# Altium schematic sheet Power_Generation.SchDoc
size A3; SheetNumber: 2; SheetTotal: 12
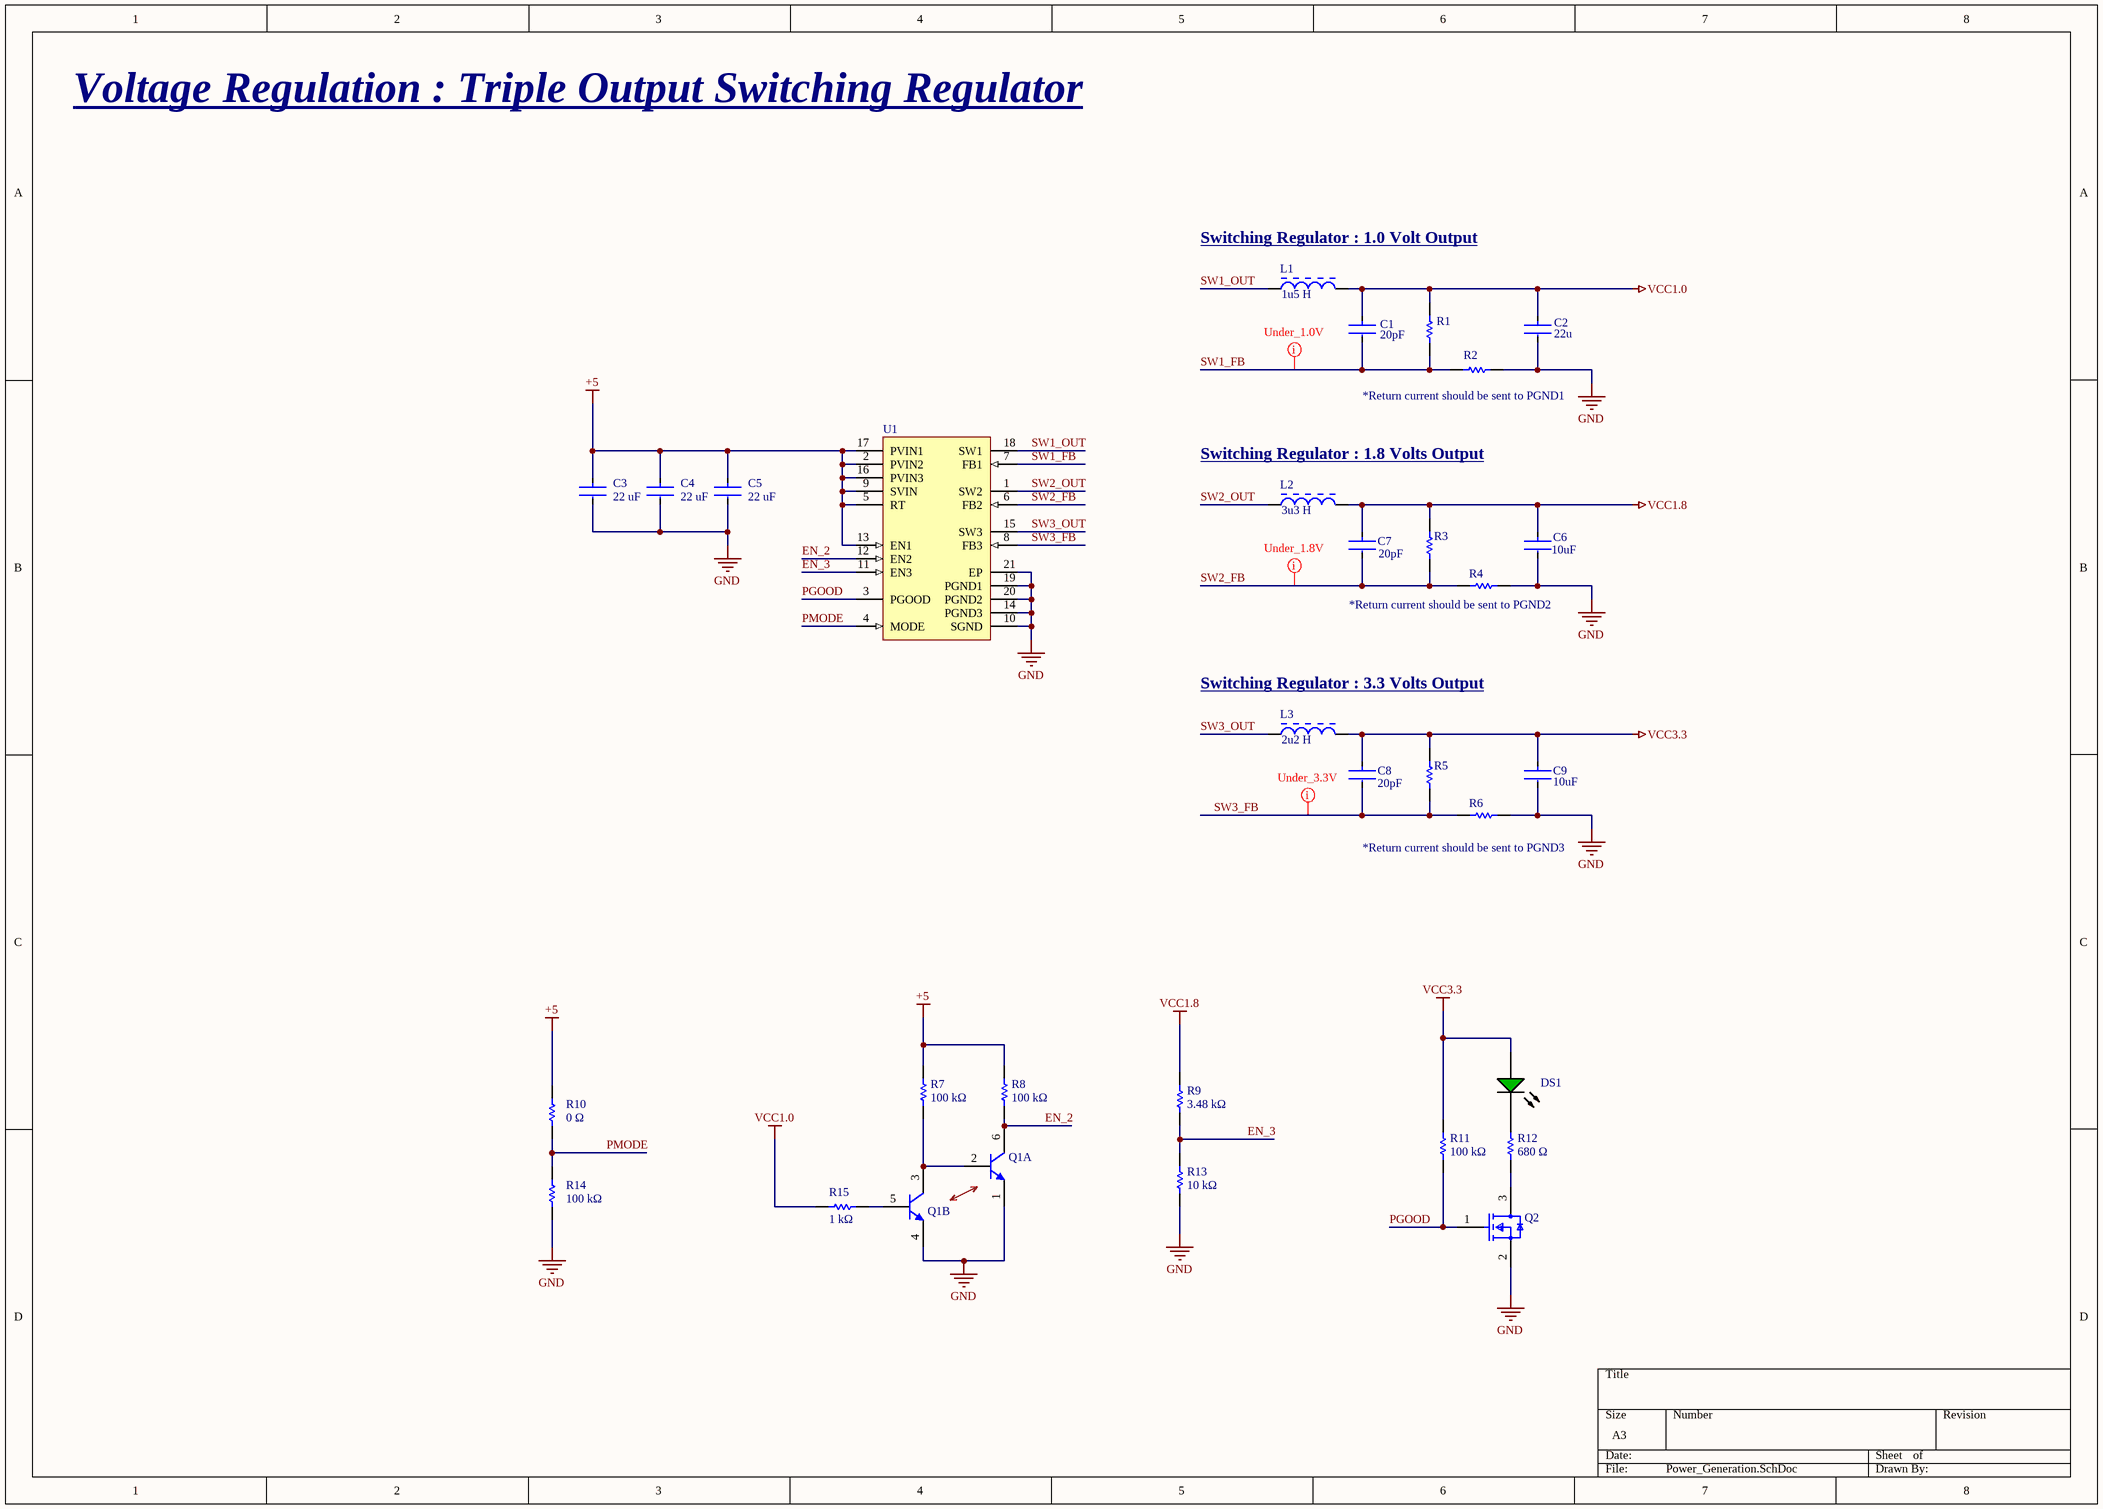
[diagram p0: Power_Generation.SchDoc]

## Parts
C1  value 20pF  [FP-C0402-BB-MFG]  (hidden comment: C0402C200J5GACTU)
C2  Capacitance: 22u  [FP-GRM21B-0_15-MFG]  (hidden comment: GRM21BR60J226ME39L)
C3  Capacitance: 22 uF  [FP-GRM21B-0_15-MFG]  (hidden comment: GRM21BR60J226ME39L)
C4  Capacitance: 22 uF  [FP-GRM21B-0_15-MFG]  (hidden comment: GRM21BR60J226ME39L)
C5  Capacitance: 22 uF  [FP-GRM21B-0_15-MFG]  (hidden comment: GRM21BR60J226ME39L)
C6  Capacitance: 10uF  [FP-GRM188-0_1-e0_2_0_55-IPC_A]  (hidden comment: GRM188R60J106ME47D)
C7  value 20pF  [FP-C0402-BB-MFG]  (hidden comment: C0402C200J5GACTU)
C8  value 20pF  [FP-C0402-BB-MFG]  (hidden comment: C0402C200J5GACTU)
C9  Capacitance: 10uF  [FP-GRM188-0_1-e0_2_0_55-IPC_A]  (hidden comment: GRM188R60J106ME47D)
DS1  HSMG-C170  [AVAG-HSMX-C170_V]  (value not drawn)
L1  Inductance: 1u5 H  [BOUR-SRN3015-2_V]  (hidden comment: SRN3015-1R5Y)
L2  Inductance: 3u3 H  [BOUR-SRN3015-2_V]  (hidden comment: SRN3015-3R3M)
L3  Inductance: 2u2 H  [BOUR-SRN3015-2_V]  (hidden comment: SRN3015-2R2M)
Q1  SMBT3904DW1T1G  [ONSC-SOT-363-6-419B-02_W_V]  (value not drawn)  (parts A,B of 2)
Q2  BSS138  [FP-318-08-IPC_B]  (value not drawn)
R1  ERJ-3GEYJ303V  [RESC1608X55X30LL15T15]  (value not drawn)
R2  ERJ1GNF1203C  [RESC0603X26X15LL03T05]  (value not drawn)
R3  RK73H1JTTD1503F  [RESC1608X55X30LL20T10]  (value not drawn)
R4  ERJ1GNF1203C  [RESC0603X26X15LL03T05]  (value not drawn)
R5  ERJ-3GEYJ184V  [RESC1608X55X30ML15T15]  (value not drawn)
R6  ERJ-3EKF5762V  [RESC1608X55X30ML15T15]  (value not drawn)
R7  Resistance: 100 kΩ  [RESC1608X55X25ML10T15]  (hidden comment: RC0603JR-070RL)
R8  Resistance: 100 kΩ  [RESC1608X55X25ML10T15]  (hidden comment: RC0603JR-070RL)
R9  Resistance: 3.48 kΩ  [RESC1608X55X25ML10T15]  (hidden comment: RC0603JR-070RL)
R10  Resistance: 0 Ω  [RESC1608X55X25NL10T15]  (hidden comment: RC0603JR-070RL)
R11  Resistance: 100 kΩ  [RESC1608X55X25ML10T15]  (hidden comment: RC0603JR-070RL)
R12  Resistance: 680 Ω  [RESC1608X55X25ML10T15]  (hidden comment: RC0603JR-070RL)
R13  Resistance: 10 kΩ  [RESC1608X55X25ML10T15]  (hidden comment: RC0603JR-070RL)
R14  Resistance: 100 kΩ  [RESC1608X55X25NL10T15]  (hidden comment: RC0603JR-070RL)
R15  Resistance: 1 kΩ  [RESC1608X55X25ML10T15]  (hidden comment: RC0603JR-070RL)
U1  LTC3569EUD#TRPBF  [LT-UD-20_M]  (value not drawn)

## Nets
+5: C3.1 C4.1 C5.1 R7.2 R8.2 R10.2 U1.2(PVIN2) U1.5(RT) U1.9(SVIN) U1.13(EN1) U1.16(PVIN3) U1.17(PVIN1)
GND: C2.2 C3.2 C4.2 C5.2 C6.2 C9.2 Q1.1(E) Q1.4(E) Q2.2(S) R2.2 R4.2 R6.2 R13.2 R14.1 U1.10(SGND) U1.14(PGND3) U1.19(PGND1) U1.20(PGND2) U1.21(EP)
VCC1.0: C1.1 C2.1 L1.2 R1.2 R15.2
VCC1.8: C6.1 C7.1 L2.2 R3.2 R9.1
VCC3.3: C8.1 C9.1 DS1.1(A) L3.2 R5.2 R11.1
EN_2: Q1.6(C) R8.1 U1.12(EN2)
EN_3: R9.2 R13.1 U1.11(EN3)
PGOOD: Q2.1(G) R11.2 U1.3(PGOOD)
PMODE: R10.1 R14.2 U1.4(MODE)
SW1_FB: C1.2 R1.1 R2.1 U1.7(FB1)
SW1_OUT: L1.1 U1.18(SW1)
SW2_FB: C7.2 R3.1 R4.1 U1.6(FB2)
SW2_OUT: L2.1 U1.1(SW2)
SW3_FB: C8.2 R5.1 R6.1 U1.8(FB3)
SW3_OUT: L3.1 U1.15(SW3)
NetDS1_2: DS1.2(K) R12.1
NetQ1_2: Q1.2(B) Q1.3(C) R7.1
NetQ1_5: Q1.5(B) R15.1
NetQ2_3: Q2.3(D) R12.2

## Layout directives
mark named Under_3.3V: SW3_FB
mark named Under_1.8V: SW2_FB
mark named Under_1.0V: SW1_FB

## Notes on the sheet
- Voltage Regulation : Triple Output Switching Regulator
- (near L1) Switching Regulator : 1.0 Volt Output
- (near R2) *Return current should be sent to PGND1
- (near L2) Switching Regulator : 1.8 Volts Output
- (near R4) *Return current should be sent to PGND2
- (near L3) Switching Regulator : 3.3 Volts Output
- (near R6) *Return current should be sent to PGND3

## Library data of the parts
C1 C7 C8 = CMP-1034-00890-3: CAP CER 20PF 50V 5% NP0 0402; Manufacturer: Kemet; Tolerance: 0.05; Material: Ceramic; Temperature Characteristic: C0G; Temperature Coefficient: 15%; Manufacturer Part Number: C0402C200J5GACTU; Octopart: https://octopart.com/c0402c200j5gactu-kemet-9143900; ComponentLink2Description: Datasheet; RoHS: TRUE; Ipc Land Pattern Name: CAPC10050X50; Temperature: -55°C to +125°C; Lead Free: Yes; Mouser Description: Multilayer Ceramic Capacitors MLCC - SMD/SMT 50volts 20pF C0G 5%; Device Class L1: Passive Components; Category: Cap; Package: C0402-BB; Temperature Range High: +125°C; Voltage Rating: 50 V; Temperature Range Low: -55°C; Device Class L2: Capacitors; Device Class L3: Ceramic Capacitors; Height: 0.55mm; Capacitance: 20 pF; ComponentLink2URL: https://content.kemet.com/datasheets/KEM_C1002_X7R_SMD.pdf; Digikey Description: CAP CER 20PF 50V 5% NP0 0402; Automotive: No
C2-C5 = CMP-2007-03385-2: Chip Multilayer Ceramic Capacitors for General Purpose, 0805, 22uF, X5R, 15%, 20%, 6.3V; Material: Ceramic; Max Operating Temperature: 85°C; Voltage: 6.3V; Min Operating Temperature: -55°C; Case/Package: 0805; Thickness: 0.053inch; Dielectric: X5R; Packaging: Tape and Reel; Depth: 1.25mm; Termination: SMD/SMT; Voltage Rating (DC): 6.3V; Radiation Hardening: No; Tolerance: 20%; Mount: Surface Mount; Lead Free: Lead Free; Package Quantity: 1; REACH SVHC: No SVHC; Voltage Rating: 6.3V; Length: 2mm; Case Code (Imperial): 0805; Case Code (Metric): 2012; Width: 0.049inch; Height: 1.25mm
C6 C9 = CMP-2006-02792-2: Chip Multilayer Ceramic Capacitors for General Purpose, 0603, 10uF, X5R, 15%, 20%, 6.3V; Packaging: Tape and Reel; Voltage Rating (DC): 6.3V; Width: 0.031inch; Termination: SMD/SMT; Dielectric: X5R; Package Quantity: 4000; Voltage Rating: 6.3V; Case/Package: 0603; Min Operating Temperature: -55°C; Voltage: 6.3V; Length: 1.6mm; Thickness: 0.035inch; Lead Free: Lead Free; Depth: 0.8mm; Case Code (Imperial): 0603; Max Operating Temperature: 85°C; Material: Ceramic; Height: 0.8mm; Tolerance: 20%; Mount: Surface Mount; REACH SVHC: No SVHC; Radiation Hardening: No; Case Code (Metric): 1608
DS1 = CMP-2000-05062-1: Chip LED, Green, 2.2 V, -40 to 85 degC, 2-Pin SMD, Pb-Free, Tape and Reel; Manufacturer: Avago; No. of Pins: 2; Peak Wavelength: 570nm; SVHC: NoSVHC(16-Jun-2014); Dominant Wavelength: 572nm; Forward Current If: 20mA; Viewing Angle: 170deg; Lens Shape: Rectangular; PIV Max: 5V; External Width: 1.25mm; LED Type: Standard; External Depth: 0.8mm; Opto Mounting Orientation: Top; Luminous Intensity: 15mcd; Luminous Intensity Min: 4mcd; Forward Voltage VF Max: 2.6V; External Length / Height: 2mm; Bulb Size: 1.25mmx1.4mm; Light Area Height: 1mm; Voltage Vf Typ: 2.2V; Operating Temperature Max: 85degC; Datasheet Version: Oct-08; MSL: MSL2A-4weeks; Peak Forward Current: 20mA; Package Description: 2-Pin Surface Mount Device, Body 2 x 1.25 mm, Height 0.8 mm; Datasheet URL: https://datasheet.ciiva.com/29280/180495-da-01-en-chip-led-hsmg-c170-gelb-gruen-29280971.pdf; Storage Temperature Min: -40degC; LED Colour: Green; Wavelength Typ: 570nm; Mounting Type: SMD; Forward Current If Max: 20mA; Dominant Wavelength Typ: 572nm; LED Mounting: SMD; Operating Temperature Range: -30degCto+85degC; Operating Temperature Min: -30degC; Manufacturer URL: http://www.avagotech.com/; Packaging: CutTape; Luminous Intensity Typ: 15mcd; Package Reference: HSMX-C170; Storage Temperature Max: 85degC; Opto Case Style: SMD; Forward Voltage: 2.2V
L1 = CMP-0007-00008-1: Semi-shielded Power Inductor, 1.5 uH, +/- 30%, 2.1 A, -40 to 125 degC, 3 x 3 x 1.5 mm SMD, RoHS and Halogen Free, Tape and Reel; Manufacturer: Bourns; SRF Min: 130 MHz; Rated current: 2.1 A; DCR Max: 0.066 Ohm; Isat: 2 A; Inductance tolerance: +/- 30%; Resistance to Solder Heat: +260 degC for 10 sec.; RoHS: TRUE; Mounting Technology: Surface Mount; ComponentLink1Description: Manufacturer URL; ComponentLink1URL: http://www.bourns.com/; PartNumber: SRN3015-1R5Y; ComponentLink3Description: Package Specification; ComponentLink3URL: http://www.bourns.com/data/global/pdfs/SRN3015.pdf; Operating Temperature: -40 to 125 degC; PackageReference: SRN3015; DatasheetVersion: Aug-11; Packing: Tape and Reel; ComponentLink2Description: Datasheet; PackageDescription: 2-Pin SMD, Body 3 x 3 mm, Height 1.5 mm; ComponentLink2URL: http://www.bourns.com/data/global/pdfs/SRN3015.pdf
L2 = CMP-0007-00001-1: Semi-shielded Power Inductor, 3.3 uH, +/- 20%, 1.6 A, -40 to 125 degC, 3 x 3 x 1.5 mm SMD, RoHS and Halogen Free, Tape and Reel; Manufacturer: Bourns; DCR Max: 0.112 Ohm; Resistance to Solder Heat: +260 degC for 10 sec.; Rated current: 1.6 A; SRF Min: 75 MHz; Isat: 1.4 A; Inductance tolerance: +/- 20%; PackageDescription: 2-Pin SMD, Body 3 x 3 mm, Height 1.5 mm; ComponentLink1URL: http://www.bourns.com/; ComponentLink3URL: http://www.bourns.com/data/global/pdfs/SRN3015.pdf; RoHS: TRUE; ComponentLink2URL: http://www.bourns.com/data/global/pdfs/SRN3015.pdf; DatasheetVersion: Aug-11; ComponentLink3Description: Package Specification; PartNumber: SRN3015-3R3M; ComponentLink2Description: Datasheet; Packing: Tape and Reel; ComponentLink1Description: Manufacturer URL; Mounting Technology: Surface Mount; PackageReference: SRN3015; Operating Temperature: -40 to 125 degC
L3 = CMP-0007-00003-1: Semi-shielded Power Inductor, 2.2 uH, +/- 20%, 1.8 A, -40 to 125 degC, 3 x 3 x 1.5 mm SMD, RoHS and Halogen Free, Tape and Reel; Manufacturer: Bourns; Isat: 1.65 A; Rated current: 1.8 A; Inductance tolerance: +/- 20%; DCR Max: 0.072 Ohm; SRF Min: 90 MHz; Resistance to Solder Heat: +260 degC for 10 sec.; Operating Temperature: -40 to 125 degC; PartNumber: SRN3015-2R2M; Packing: Tape and Reel; ComponentLink3Description: Package Specification; ComponentLink2Description: Datasheet; RoHS: TRUE; ComponentLink3URL: http://www.bourns.com/data/global/pdfs/SRN3015.pdf; PackageDescription: 2-Pin SMD, Body 3 x 3 mm, Height 1.5 mm; ComponentLink1URL: http://www.bourns.com/; ComponentLink1Description: Manufacturer URL; DatasheetVersion: Aug-11; Mounting Technology: Surface Mount; ComponentLink2URL: http://www.bourns.com/data/global/pdfs/SRN3015.pdf; PackageReference: SRN3015
Q1 = CMP-1048-00884-1: Dual General Purpose Transistors, 6-Pin SOT-363, Pb-Free, Tape and Reel; Manufacturer: On Semiconductor; fT Min (MHz): 300; Polarity: Dual NPN; IC Continuous (A): 0.2; Packing: Tape and Reel; DatasheetVersion: Rev. 9; PackageDescription: 6-Pin Small Outline Transistor, Body 2 x 1.25 mm, Pitch 0.65 mm; PartNumber: SMBT3904DW1T1G; ComponentLink1Description: Manufacturer URL; ComponentLink3URL: http://www.onsemi.com/pub_link/Collateral/NTJD4001N-D.PDF; RoHS: TRUE; ComponentLink1URL: http://www.onsemi.com/; Mounting Technology: Surface Mount; ComponentLink2Description: Datasheet; PackageVersion: Rev. W, 01/2006; ComponentLink3Description: Package Specification; PackageReference: SOT-363-6-419B-02_W; ComponentLink2URL: http://www.onsemi.com/pub_link/Collateral/MBT3904DW1T1-D.PDF
Q2 = CMP-07173-000101-1: MOSFET N-CH 50V 220MA SOT-23; Turn-Off Delay Time: 20ns; Element Configuration: Single; Rds On Max: 3.5R; Gate to Source Voltage (Vgs): 20V; Threshold Voltage: 1.3V; Number of Elements: 1; Power Dissipation: 360mW; Rise Time: 9ns; Turn-On Delay Time: 2.5ns; Input Capacitance: 27pF; On-State Resistance: 6R; Lead Free: Lead Free; Length: 2.92mm; Width: 1.3mm; Drain to Source Breakdown Voltage: 50V; Min Operating Temperature: -55°C; REACH SVHC: No SVHC; Packaging: Tape and Reel; Radiation Hardening: No; Height: 0.93mm; Drain to Source Voltage (Vdss): 50V; Current Rating: 220mA; Voltage Rating (DC): 50V; Weight: 0.03g; Continuous Drain Current (ID): 220mA; Number of Pins: 3; Nominal Vgs: 1.3V; Max Power Dissipation: 360mW; Fall Time: 9ns; Drain to Source Resistance: 3.5R; Contact Plating: Tin; Case/Package: SOT-23; Package Quantity: 1; Dual Supply Voltage: 50V; Mount: Surface Mount; Termination: SMD/SMT; Max Operating Temperature: 150°C
R1 = CMP-1012-00109-2: Manufacturer: Panasonic; Part Number: ERJ-3GEYJ303V
R2 = CMP-1010-00650-2: Manufacturer: Panasonic; Resistance: 120kΩ; Part Number: ERJ1GNF1203C
R3 = CMP-2000-01198-1: Manufacturer: KOA Speer; Part Number: RK73H1JTTD1503F
R4 = CMP-1010-00650-2: Manufacturer: Panasonic; Part Number: ERJ1GNF1203C
R5 = CMP-2000-00736-1: Manufacturer: Panasonic; Part Number: ERJ-3GEYJ184V
R6 = CMP-2000-00576-1: Manufacturer: Panasonic; Part Number: ERJ-3EKF5762V
R7-R15 = CMP-2100-03667-1: Chip Resistor, 0 Ohm, +/- 5%, 0.1 W, -55 to 155 degC, 0603 (1608 Metric), RoHS, Tape and Reel; Manufacturer: Yageo; Temperature Coefficient: 200ppm/degreesC; Voltage Rating: 50V; Power Rating: 100mW; Width: 0.8mm; Max Operating Temperature: 155degC; Tolerance: 5%; Package Reference: 0603; Height: 0.45mm; Depth: 0.8mm; Package Description: 2-Pin Surface Mount Device, Body 1.6 x 0.8 mm; Termination: SMD/SMT; Package Quantity: 5000; Case/Package: 0603; Case Code (Imperial): 0603; Radiation Hardening: No; Number of Pins: 2; Length: 1.6mm; Lead Free: LeadFree; Voltage Rating (DC): 50V; Military Standard: Not; Datasheet URL: http://www.yageo.com/NewPortal/yageodocoutput?fileName=/pdf/R-Chip/PYu-RC_Group_51_RoHS_L_5.pdf; Manufacturer URL: http://www.yageo.com/; Packaging: TapeandReel; Case Code (Metric): 1608; Min Operating Temperature: -55degC; Composition: ThickFilm; RoHSCompliant: true; Contact Plating: Tin; Datasheet Version: Rev. 5, 10/2016; REACH SVHC: NoSVHC
U1 = CMP-0492-02156-1: Triple Buck Regulator with 1.2 A and Two 600 mA Outputs and Individual Programmable References, 20-pin QFN (UD-20), -40 to 125 degC, Pb-Free, Tape and Reel; Manufacturer: Linear Technology; Frequency Adjust Range: 1MHz - 3MHz; Number of Outputs: 3; ComponentLink3URL: http://cds.linear.com/docs/en/packaging/QFN_20_05-08-1720.pdf; ComponentLink1Description: Manufacturer URL; ComponentLink2Description: Datasheet; PackageReference: UD-20; Mounting Technology: Surface Mount; Packing: Tape and Reel; PartNumber: LTC3569EUD#TRPBF; ComponentLink1URL: http://www.linear.com/; RoHS: TRUE; PackageVersion: Rev. A, 06/2010; ComponentLink2URL: https://www.analog.com/media/en/technical-documentation/data-sheets/3569fe.pdf; DatasheetVersion: Rev. D; PackageDescription: 20-Pin Plastic QFN, Body 3 x 3 mm, Pitch 0.4 mm; ComponentLink3Description: Package Specification